# EAGLE schematic 5mmtermCuringCircuit (EAGLE 9.4.1)

## Sheet 1 of 2
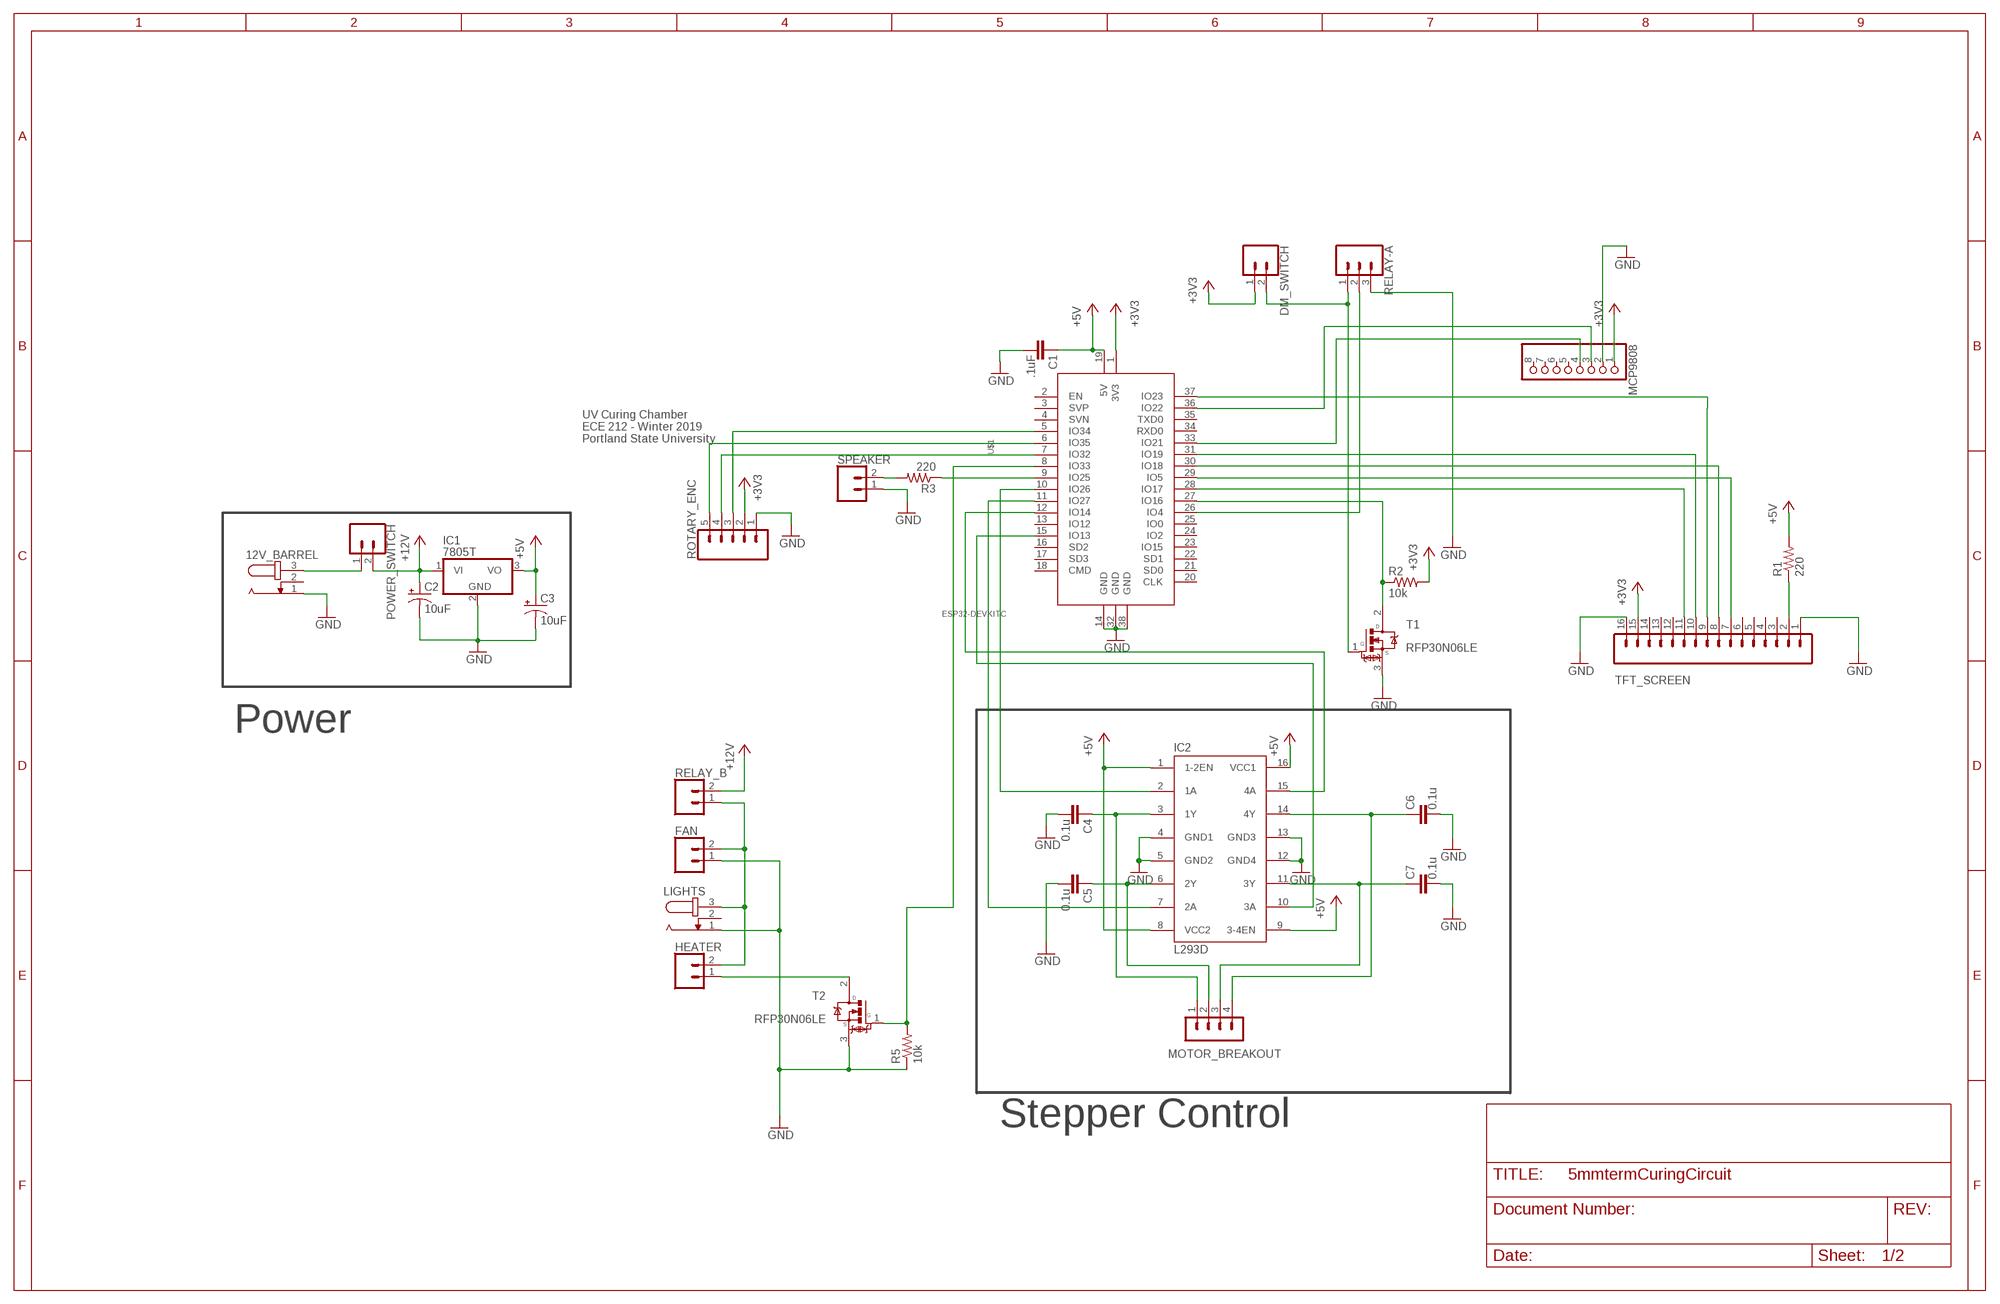
[diagram p0: schematic, sheet 1]

### Parts
12V_BARREL  JACK-PLUG0  [SPC4077]
C1  .1uF  C-EU075-063X106  [C075-063X106]
C2  10uF  CPOL-USE1.8-4  [E1,8-4]
C3  10uF  CPOL-USE1.8-4  [E1,8-4]
C4  0.1u  C-EU075-063X106  [C075-063X106]
C5  0.1u  C-EU075-063X106  [C075-063X106]
C6  0.1u  C-EU075-063X106  [C075-063X106]
C7  0.1u  C-EU075-063X106  [C075-063X106]
DM_SWITCH  CONN_025MM  [SCREWTERMINAL-5MM-2]
FAN  CONN_025MM  [SCREWTERMINAL-5MM-2]
HEATER  CONN_025MM  [SCREWTERMINAL-5MM-2]
IC1  7805T  [TO220H]
IC2  L293D  [DIL16]
LIGHTS  JACK-PLUG0  [SPC4077]
MCP9808  PINHD-1X8BIG  [1X08-BIG]
MOTOR_BREAKOUT  MA04-1  [MA04-1]
POWER_SWITCH  CONN_025MM  [SCREWTERMINAL-5MM-2]
R1  220  R-US_0207/10  [0207/10]
R2  10k  R-US_0207/10  [0207/10]
R3  220  R-US_0207/10  [0207/10]
R5  10k  R-US_0207/10  [0207/10]
RELAY-A  CONN_03-SCREW-5MM  [SCREWTERMINAL-5MM-3]
RELAY_B  CONN_025MM  [SCREWTERMINAL-5MM-2]
ROTARY_ENC  CONN_05  [1X05]
SPEAKER  CONN_025MM  [SCREWTERMINAL-5MM-2]
T1  RFP30N06LE  [TRANS_RFP30N06LE]
T2  RFP30N06LE  [TRANS_RFP30N06LE]
TFT_SCREEN  CONN_16  [1X16]
U$1  ESP32DEVKITC  [ESP32-DEVKITC]

### Nets
+3V3: DM_SWITCH.1 MCP9808.1 R2.2 ROTARY_ENC.2 TFT_SCREEN.15 U$1.1(3V3)
+5V: C1.1 C3.+ IC1.3(VO) IC2.1(1-2EN) IC2.8(VCC2) IC2.9(3-4EN) IC2.16(VCC1) R1.2 U$1.19(5V)
GND: 12V_BARREL.1 C1.2 C2.- C3.- C4.2 C5.2 C6.2 C7.2 FAN.1 IC1.2(GND) IC2.4(GND1) IC2.5(GND2) IC2.12(GND4) IC2.13(GND3) LIGHTS.1 MCP9808.2 R5.1 RELAY-A.3 ROTARY_ENC.1 SPEAKER.1 T1.3(S) T2.3(S) TFT_SCREEN.1 TFT_SCREEN.16 U$1.14(GND) U$1.32(GND) U$1.38(GND)
N$1: TFT_SCREEN.9 U$1.37(IO23)
N$2: IC2.15(4A) U$1.12(IO14)
N$3 [thick]: 12V_BARREL.3 POWER_SWITCH.1
N$4: HEATER.1 T2.2(D)
N$5: IC2.7(2A) U$1.11(IO27)
N$6: R3.2 SPEAKER.2
N$7: C5.1 IC2.6(2Y) MOTOR_BREAKOUT.2
N$8: DM_SWITCH.2 RELAY-A.1 T1.1(G)
N$9: R2.1 T1.2(D) U$1.27(IO16)
N$10: MCP9808.3 U$1.36(IO22)
N$11: MCP9808.4 U$1.33(IO21)
N$13: IC2.2(1A) U$1.10(IO26)
N$14: R5.2 T2.1(G) U$1.8(IO33)
N$15: C4.1 IC2.3(1Y) MOTOR_BREAKOUT.1
N$16: RELAY-A.2 U$1.26(IO4)
N$17: R1.1 TFT_SCREEN.2
N$18: ROTARY_ENC.3 U$1.5(IO34)
N$19: ROTARY_ENC.4 U$1.7(IO32)
N$20: ROTARY_ENC.5 U$1.6(IO35)
N$21: TFT_SCREEN.11 U$1.28(IO17)
N$22: TFT_SCREEN.10 U$1.31(IO19)
N$23: C7.1 IC2.11(3Y) MOTOR_BREAKOUT.3
N$24: TFT_SCREEN.8 U$1.30(IO18)
N$25: TFT_SCREEN.7 U$1.29(IO5)
N$26: R3.1 U$1.9(IO25)
N$27: C6.1 IC2.14(4Y) MOTOR_BREAKOUT.4
N$28 [thick]: FAN.2 HEATER.2 LIGHTS.3 RELAY_B.1
N$29: IC2.10(3A) U$1.15(IO13)
V+ [thick]: C2.+ IC1.1(VI) POWER_SWITCH.2 RELAY_B.2 ; supply symbol labelled +12V
Unconnected: 12V_BARREL.2 LIGHTS.2 MCP9808.5 MCP9808.6 MCP9808.7 MCP9808.8 TFT_SCREEN.3 TFT_SCREEN.4 TFT_SCREEN.5 TFT_SCREEN.6 TFT_SCREEN.12 TFT_SCREEN.13 TFT_SCREEN.14 U$1.2(EN) U$1.3(SVP) U$1.4(SVN) U$1.13(IO12) U$1.16(SD2) U$1.17(SD3) U$1.18(CMD) U$1.20(CLK) U$1.21(SD0) U$1.22(SD1) U$1.23(IO15) U$1.24(IO2) U$1.25(IO0) U$1.34(RXD0) U$1.35(TXD0)

### Notes on the sheet
- UV Curing Chamber
  ECE 212 - Winter 2019
  Portland State University
- Power
- Stepper Control

## Sheet 2 of 2

## Library data of the parts
12V_BARREL LIGHTS = con-jack:JACK-PLUG: DC POWER JACK Power Jack, DC, Right Angle, Through Hole, Rated 5A at 16VDC, PC Terminals Distributor: Farnell (www.Farnell.de) Drawing: 84N1161.pdf / 84N1162.pdf Manufacturer: SPC Technology (www.spctechnology.com) Type: SPC4077 / SPC 4078; OC_FARNELL: unknown; OC_NEWARK: unknown
C1 C4-C7 = rcl:C-EU: CAPACITOR, European symbol; SPICEPREFIX: C
C2 C3 = rcl:CPOL-US: POLARIZED CAPACITOR, American symbol; SPICEPREFIX: C
DM_SWITCH FAN HEATER POWER_SWITCH RELAY_B SPEAKER = SparkFun-Connectors:CONN_02: Multi connection point. Often used as Generic Header-pin footprint for 0.1 inch spaced/style header connections On any of the 0.1 inch spaced packages, you can populate with these: Break Away Headers - Straight <https://www.sparkfun.com/products/116> (PRT-00116) Break Away Male Headers - Right Angle <https://www.sparkfun.com/products/553> (PRT-00553) Female Headers <https://www.sparkfun.com/products/115> (PRT-00115) Break Away Headers - Machine Pin <https://www.sparkfun.com/products/117> (PRT-00117) Break Away Female Headers - Swiss Machine Pin <https://www.sparkfun.com/products/743> (PRT-00743) For SCREWTERMINALS and SPRING TERMINALS visit here: Screw Terimnals on SparkFun.com <https://www.sparkfun.com/search/results?term=Screw+Terminals> (5mm/3.5mm/2.54mm spacing) This device is also useful as a general connection point to wire up your design to another part of your project. Our various solder wires solder well into these plated through hole pads. Hook-Up Wire - Assortment (Stranded, 22 AWG) <https://www.sparkfun.com/products/11375> (PRT-11375) Hook-Up Wire - Assortment (Solid Core, 22 AWG) <https://www.sparkfun.com/products/11367> (PRT-11367) View the entire wire category on our website here <https://www.sparkfun.com/categories/141> Special notes: Molex polarized connector foot print use with: PRT-08233 with associated crimp pins and housings. 2.54_SCREWTERM for use with PRT-10571. 3.5mm Screw Terminal footprints for PRT-08084 5mm Screw Terminal footprints for use with PRT-08432; SF_SKU: PRT-08432
IC1 = linear:78*: Positive VOLTAGE REGULATOR Source: http://cache.national.com/ds/LM/LM78L05.pdf http://www.fairchildsemi.com/ds/LM/LM7805.pdf
IC2 = st-microelectronics:L293D: PUSH-PULL 4 CHANNEL DRIVER; MPN: L293D; OC_FARNELL: 9589619; OC_NEWARK: 56P8249
MCP9808 = adafruit:PINHD-1X8: PIN HEADER
MOTOR_BREAKOUT = con-lstb:MA04-1: PIN HEADER; OC_FARNELL: unknown; OC_NEWARK: unknown
R1-R3 R5 = rcl:R-US_: RESISTOR, American symbol; SPICEPREFIX: R
RELAY-A = SparkFun-Connectors:CONN_03: Multi connection point. Often used as Generic Header-pin footprint for 0.1 inch spaced/style header connections On any of the 0.1 inch spaced packages, you can populate with these: Break Away Headers - Straight <https://www.sparkfun.com/products/116> (PRT-00116) Break Away Male Headers - Right Angle <https://www.sparkfun.com/products/553> (PRT-00553) Female Headers <https://www.sparkfun.com/products/115> (PRT-00115) Break Away Headers - Machine Pin <https://www.sparkfun.com/products/117> (PRT-00117) Break Away Female Headers - Swiss Machine Pin <https://www.sparkfun.com/products/743> (PRT-00743) Stackable Header - 3 Pin (Female, 0.1") <https://www.sparkfun.com/products/13875> (PRT-13875) For SCREWTERMINALS and SPRING TERMINALS visit here: Screw Terimnals on SparkFun.com <https://www.sparkfun.com/search/results?term=Screw+Terminals> (5mm/3.5mm/2.54mm spacing) This device is also useful as a general connection point to wire up your design to another part of your project. Our various solder wires solder well into these plated through hole pads. Hook-Up Wire - Assortment (Stranded, 22 AWG) <https://www.sparkfun.com/products/11375> (PRT-11375) Hook-Up Wire - Assortment (Solid Core, 22 AWG) <https://www.sparkfun.com/products/11367> (PRT-11367) View the entire wire category on our website here <https://www.sparkfun.com/categories/141> Special notes: Molex polarized connector foot print use with SKU : PRT-08232 with associated crimp pins and housings.; PROD_ID: CONN-10134; SF_SKU: PRT-08433
ROTARY_ENC = SparkFun-Connectors:CONN_05: Multi connection point. Often used as Generic Header-pin footprint for 0.1 inch spaced/style header connections On any of the 0.1 inch spaced packages, you can populate with these: Break Away Headers - Straight <https://www.sparkfun.com/products/116> (PRT-00116) Break Away Male Headers - Right Angle <https://www.sparkfun.com/products/553> (PRT-00553) Female Headers <https://www.sparkfun.com/products/115> (PRT-00115) Break Away Headers - Machine Pin <https://www.sparkfun.com/products/117> (PRT-00117) Break Away Female Headers - Swiss Machine Pin <https://www.sparkfun.com/products/743> (PRT-00743) For SCREWTERMINALS and SPRING TERMINALS visit here: Screw Terimnals on SparkFun.com <https://www.sparkfun.com/search/results?term=Screw+Terminals> (5mm/3.5mm/2.54mm spacing) This device is also useful as a general connection point to wire up your design to another part of your project. Our various solder wires solder well into these plated through hole pads. Hook-Up Wire - Assortment (Stranded, 22 AWG) <https://www.sparkfun.com/products/11375> (PRT-11375) Hook-Up Wire - Assortment (Solid Core, 22 AWG) <https://www.sparkfun.com/products/11367> (PRT-11367) View the entire wire category on our website here <https://www.sparkfun.com/categories/141> Special notes: Molex polarized connector foot print use with SKU : PRT-08231 with associated crimp pins and housings. 1MM SMD Version SKU: PRT-10208
T1 T2 = RFP30N06LE:RFP30N06LE: Mosfet n-Ch 60v 30a To-220ab - Rfp30n06le; AVAILABILITY: Unavailable; MF: ON Semiconductor; MP: RFP30N06LE; PACKAGE: TO-220 Intersil; PRICE: None
TFT_SCREEN = SparkFun-Connectors:CONN_16: Multi connection point. Often used as Generic Header-pin footprint for 0.1 inch spaced/style header connections On any of the 0.1 inch spaced packages, you can populate with these: Break Away Headers - Straight <https://www.sparkfun.com/products/116> (PRT-00116) Break Away Male Headers - Right Angle <https://www.sparkfun.com/products/553> (PRT-00553) Female Headers <https://www.sparkfun.com/products/115> (PRT-00115) Break Away Headers - Machine Pin <https://www.sparkfun.com/products/117> (PRT-00117) Break Away Female Headers - Swiss Machine Pin <https://www.sparkfun.com/products/743> (PRT-00743) For SCREWTERMINALS and SPRING TERMINALS visit here: Screw Terimnals on SparkFun.com <https://www.sparkfun.com/search/results?term=Screw+Terminals> (5mm/3.5mm/2.54mm spacing) This device is also useful as a general connection point to wire up your design to another part of your project. Our various solder wires solder well into these plated through hole pads. Hook-Up Wire - Assortment (Stranded, 22 AWG) <https://www.sparkfun.com/products/11375> (PRT-11375) Hook-Up Wire - Assortment (Solid Core, 22 AWG) <https://www.sparkfun.com/products/11367> (PRT-11367) View the entire wire category on our website here <https://www.sparkfun.com/categories/141> Special notes: Molex polarized connector foot print use with SKU : PRT-08231 with associated crimp pins and housings. 1MM SMD Version SKU: PRT-10208 NOTES ON THE VARIANTS LOCK and LOCK_LONGPADS... This footprint was designed to help hold the alignment of a through-hole component (i.e. 6-pin header) while soldering it into place. You may notice that each hole has been shifted either up or down by 0.005 of an inch from it's more standard position (which is a perfectly straight line). This slight alteration caused the pins (the squares in the middle) to touch the edges of the holes. Because they are alternating, it causes a "brace" to hold the component in place. 0.005 has proven to be the perfect amount of "off-center" position when using our standard breakaway headers. Although looks a little odd when you look at the bare footprint, once you have a header in there, the alteration is very hard to notice. Also,if you push a header all the way into place, it is covered up entirely on the bottom side.
U$1 = ESP32-DEVKITC:ESP32DEVKITC

## Net classes
0 default: width 0.508 mm, drill 1.5 mm, clearance 0.381 mm
1 thick: width 1.27 mm, drill 1.199 mm, clearance 0.381 mm
2 high current: width 4.318 mm, drill 1.199 mm, clearance 0.381 mm